# Altium schematic sheet Heater.SchDoc: Heater
size 420 x 297 mm; EDA_Number: ARTIQ; Projet: GPSDO; Author: K.Belewicz/M.Beldyga; CompanyName: WUT ISE; DrawnBy: K.Belewicz/M.Beldyga; Organization: WUT ISE; Address1: PW ISE; Address2: Nowowiejska 15/19 00-665 Warsaw; Address3: gkasprow@gmail.com; Revision: 1; SheetNumber: 3; SheetTotal: 7; ModifiedBy: -; CheckedDate: -; DivGrp: WUT ISE; Designer: G.Kasprowicz; ModifiedDate: -; ProjectName: Sensor Box
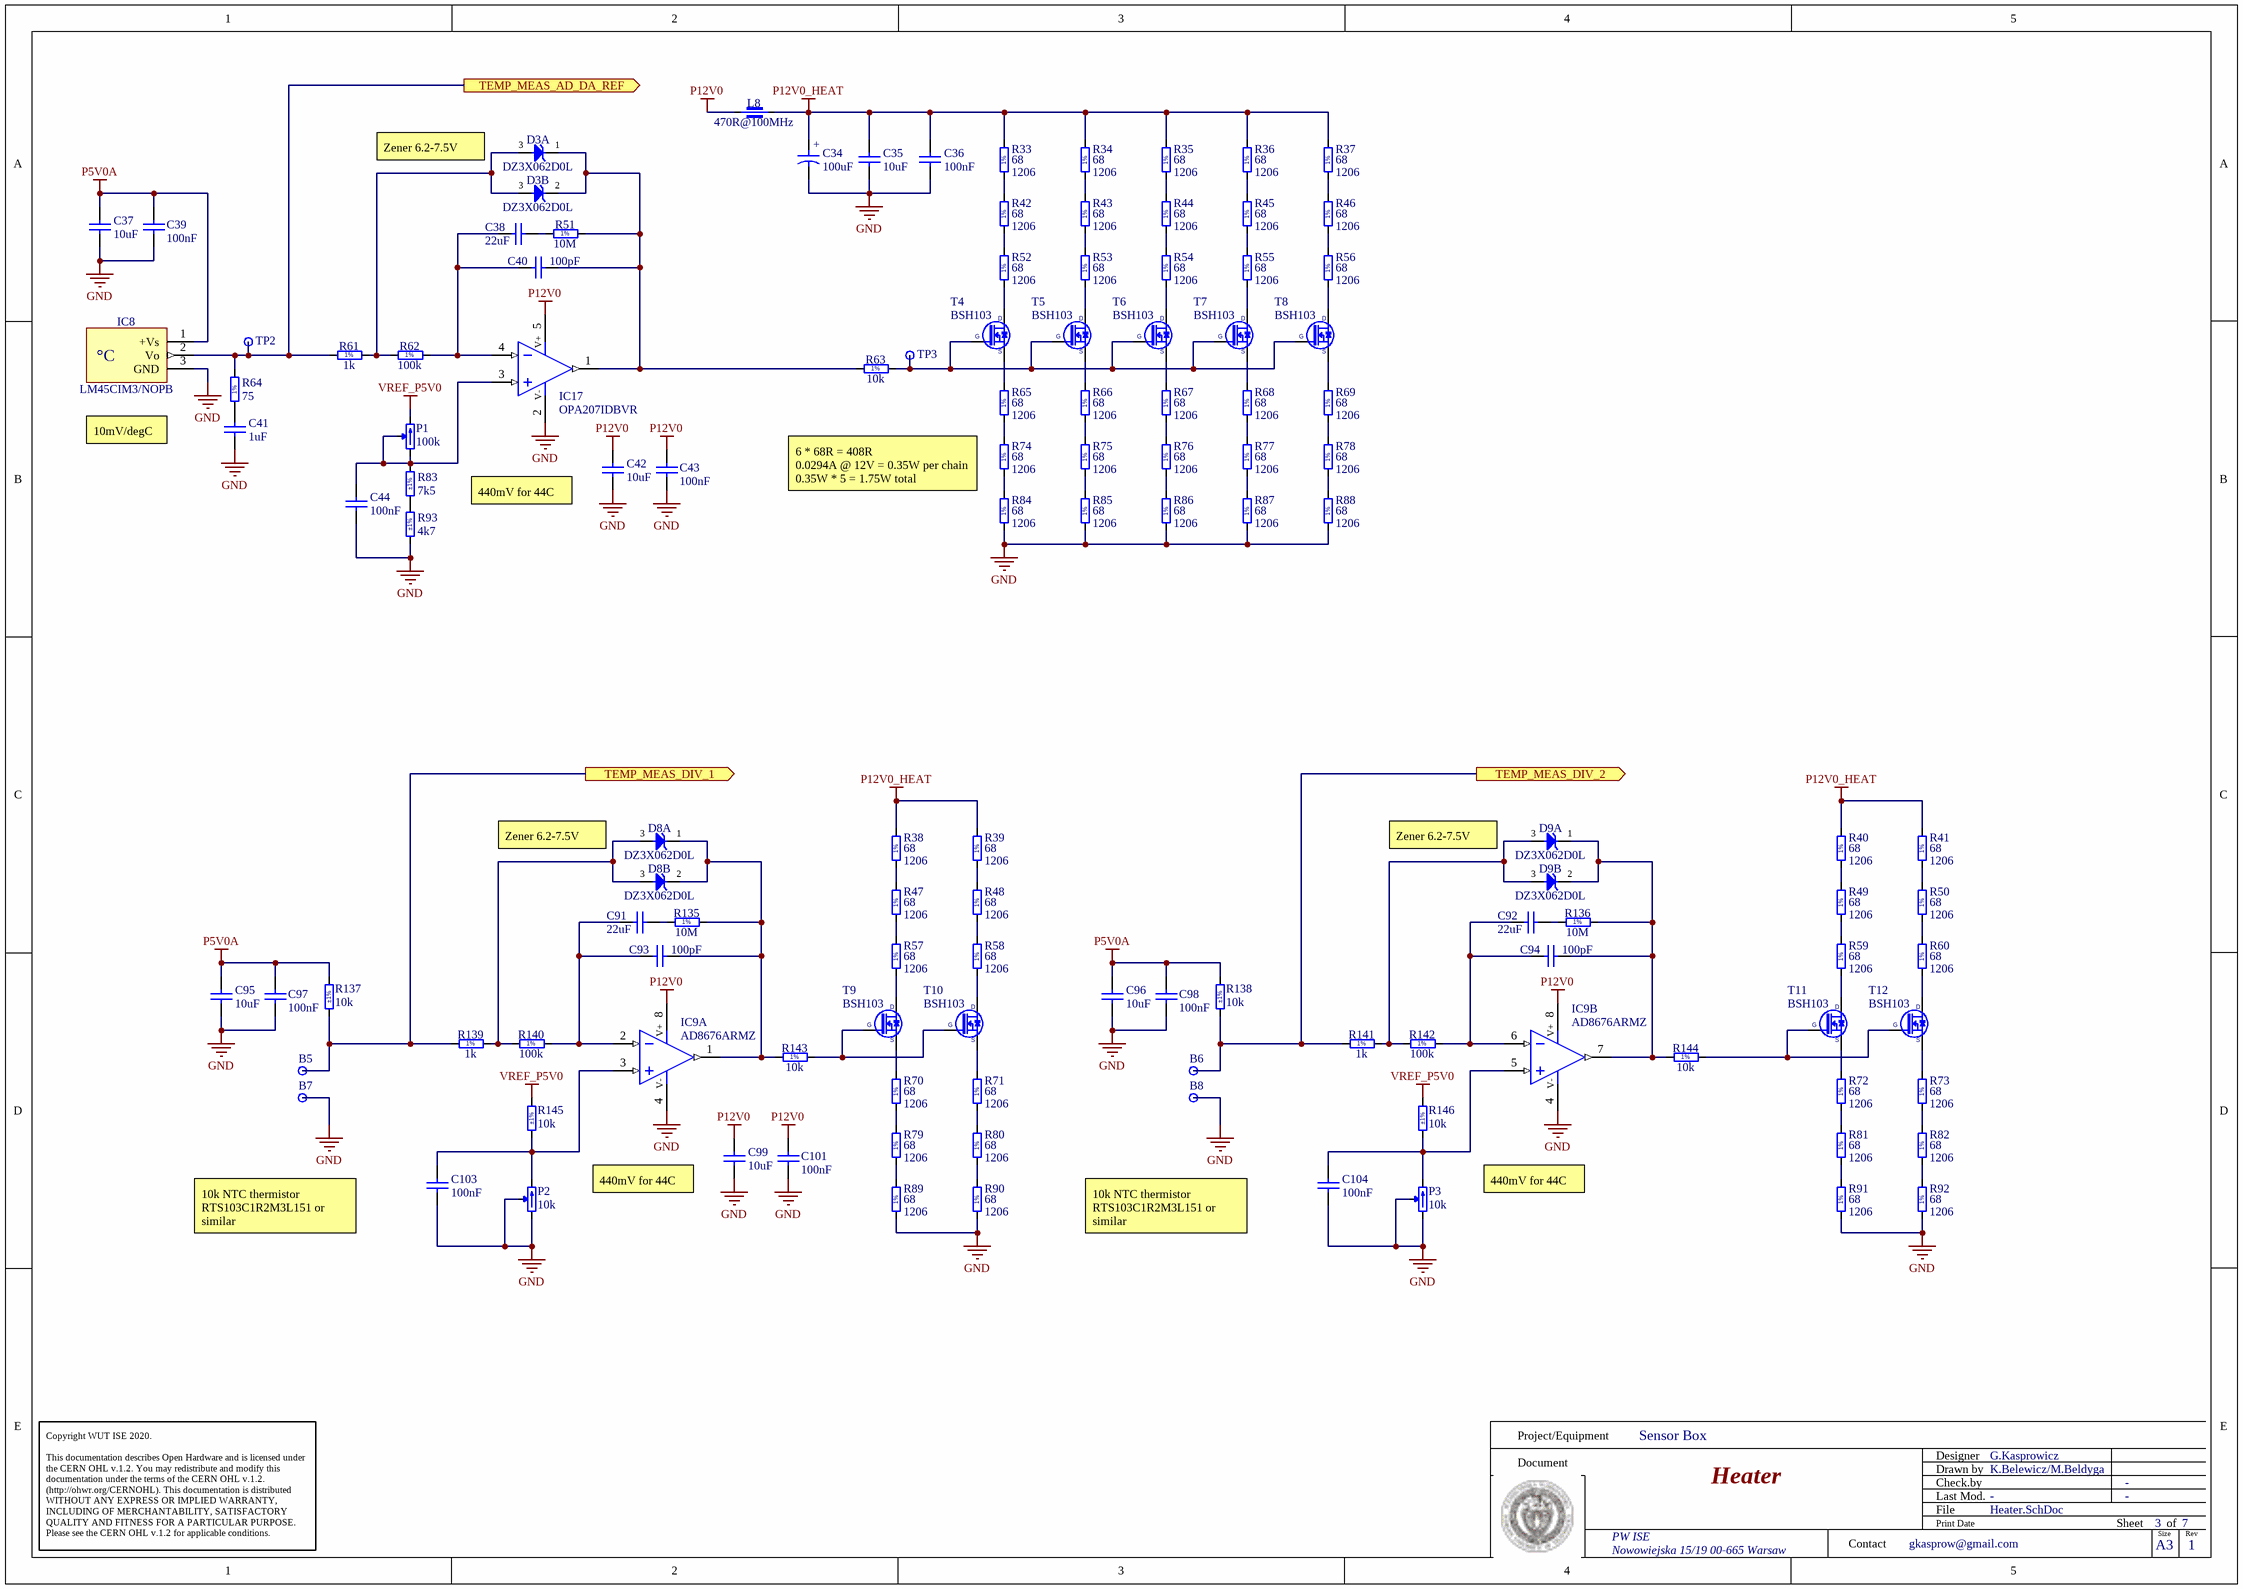
[diagram p0: Heater.SchDoc]

## Parts
B5  Plated Hole  [c150h80]  (value not drawn)  (no BOM)
B6  Plated Hole  [c150h80]  (value not drawn)  (no BOM)
B7  Plated Hole  [c150h80]  (value not drawn)  (no BOM)
B8  Plated Hole  [c150h80]  (value not drawn)  (no BOM)
C34  100uF  [CAPMP7343X310N]
C35  10uF  [CAPC1608X80N]
C36  100nF  [CAPC1005X55N]
C37  10uF  [CAPC1608X80N]
C38  22uF  [CAPC2012X135N]
C39  100nF  [CAPC1005X55N]
C40  100pF  [CAPC1005X55N]
C41  1uF  [CAPC1005X55N]
C42  10uF  [CAPC1608X80N]
C43  100nF  [CAPC1005X55N]
C44  100nF  [CAPC1005X55N]
C91  22uF  [CAPC2012X135N]
C92  22uF  [CAPC2012X135N]
C93  100pF  [CAPC1005X55N]
C94  100pF  [CAPC1005X55N]
C95  10uF  [CAPC1608X80N]
C96  10uF  [CAPC1608X80N]
C97  100nF  [CAPC1005X55N]
C98  100nF  [CAPC1005X55N]
C99  10uF  [CAPC1608X80N]
C101  100nF  [CAPC1005X55N]
C103  100nF  [CAPC1005X55N]
C104  100nF  [CAPC1005X55N]
D3  DZ3X062D0L  [SOT95P275X140-3N]  (parts A,B of 2)
D8  DZ3X062D0L  [SOT95P275X140-3N]  (parts A,B of 2)
D9  DZ3X062D0L  [SOT95P275X140-3N]  (parts A,B of 2)
IC8  LM45CIM3/NOPB  [SOT95P251X112-3N]
IC9  AD8676ARMZ  [SOP65P490X110-8N]  (parts A,B of 2)
IC17  OPA207IDBVR  [SOT95P280X145-5N]
L8  470R@100MHz  [INDC1608X95N]
P1  100k  [TRIM_BOURNS_3224X]
P2  10k  [TRIM_BOURNS_3224X]
P3  10k  [TRIM_BOURNS_3224X]
R33  68  Case: 1206  [RESC3216X65N]
R34  68  Case: 1206  [RESC3216X65N]
R35  68  Case: 1206  [RESC3216X65N]
R36  68  Case: 1206  [RESC3216X65N]
R37  68  Case: 1206  [RESC3216X65N]
R38  68  Case: 1206  [RESC3216X65N]
R39  68  Case: 1206  [RESC3216X65N]
R40  68  Case: 1206  [RESC3216X65N]
R41  68  Case: 1206  [RESC3216X65N]
R42  68  Case: 1206  [RESC3216X65N]
R43  68  Case: 1206  [RESC3216X65N]
R44  68  Case: 1206  [RESC3216X65N]
R45  68  Case: 1206  [RESC3216X65N]
R46  68  Case: 1206  [RESC3216X65N]
R47  68  Case: 1206  [RESC3216X65N]
R48  68  Case: 1206  [RESC3216X65N]
R49  68  Case: 1206  [RESC3216X65N]
R50  68  Case: 1206  [RESC3216X65N]
R51  10M  [RESC2113X55N]
R52  68  Case: 1206  [RESC3216X65N]
R53  68  Case: 1206  [RESC3216X65N]
R54  68  Case: 1206  [RESC3216X65N]
R55  68  Case: 1206  [RESC3216X65N]
R56  68  Case: 1206  [RESC3216X65N]
R57  68  Case: 1206  [RESC3216X65N]
R58  68  Case: 1206  [RESC3216X65N]
R59  68  Case: 1206  [RESC3216X65N]
R60  68  Case: 1206  [RESC3216X65N]
R61  1k  [RESC1005X40N]
R62  100k  [RESC1005X40N]
R63  10k  [RESC1005X40N]
R64  75  [RESC1005X40N]
R65  68  Case: 1206  [RESC3216X65N]
R66  68  Case: 1206  [RESC3216X65N]
R67  68  Case: 1206  [RESC3216X65N]
R68  68  Case: 1206  [RESC3216X65N]
R69  68  Case: 1206  [RESC3216X65N]
R70  68  Case: 1206  [RESC3216X65N]
R71  68  Case: 1206  [RESC3216X65N]
R72  68  Case: 1206  [RESC3216X65N]
R73  68  Case: 1206  [RESC3216X65N]
R74  68  Case: 1206  [RESC3216X65N]
R75  68  Case: 1206  [RESC3216X65N]
R76  68  Case: 1206  [RESC3216X65N]
R77  68  Case: 1206  [RESC3216X65N]
R78  68  Case: 1206  [RESC3216X65N]
R79  68  Case: 1206  [RESC3216X65N]
R80  68  Case: 1206  [RESC3216X65N]
R81  68  Case: 1206  [RESC3216X65N]
R82  68  Case: 1206  [RESC3216X65N]
R83  7k5  Tolerance: ±1%  [RESC1005X40N]
R84  68  Case: 1206  [RESC3216X65N]
R85  68  Case: 1206  [RESC3216X65N]
R86  68  Case: 1206  [RESC3216X65N]
R87  68  Case: 1206  [RESC3216X65N]
R88  68  Case: 1206  [RESC3216X65N]
R89  68  Case: 1206  [RESC3216X65N]
R90  68  Case: 1206  [RESC3216X65N]
R91  68  Case: 1206  [RESC3216X65N]
R92  68  Case: 1206  [RESC3216X65N]
R93  4k7  Tolerance: ±1%  [RESC1005X40N]
R135  10M  [RESC2113X55N]
R136  10M  [RESC2113X55N]
R137  10k  Tolerance: ±1%  [RESC1005X40N]
R138  10k  Tolerance: ±1%  [RESC1005X40N]
R139  1k  [RESC1005X40N]
R140  100k  [RESC1005X40N]
R141  1k  [RESC1005X40N]
R142  100k  [RESC1005X40N]
R143  10k  [RESC1005X40N]
R144  10k  [RESC1005X40N]
R145  10k  Tolerance: ±1%  [RESC1005X40N]
R146  10k  Tolerance: ±1%  [RESC1005X40N]
T4  BSH103  [SOT95P230X110-3N]
T5  BSH103  [SOT95P230X110-3N]
T6  BSH103  [SOT95P230X110-3N]
T7  BSH103  [SOT95P230X110-3N]
T8  BSH103  [SOT95P230X110-3N]
T9  BSH103  [SOT95P230X110-3N]
T10  BSH103  [SOT95P230X110-3N]
T11  BSH103  [SOT95P230X110-3N]
T12  BSH103  [SOT95P230X110-3N]
TP2  Test Point  [TPS127]  (value not drawn)  (no BOM)
TP3  Test Point  [TPS127]  (value not drawn)  (no BOM)

## Ports
TEMP_MEAS_AD_DA_REF (out), TEMP_MEAS_DIV_1 (out), TEMP_MEAS_DIV_2 (out)

## Nets
GND: B7.1 B8.1 C34.2 C35.1 C36.1 C37.1 C39.1 C41.1 C42.1 C43.1 C44.1 C95.1 C96.1 C97.1 C98.1 C99.1 C101.1 C103.1 C104.1 IC8.3(GND) IC9.4(V-) IC17.2(V-) P2.1(CCW) P2.2(W) P3.1(CCW) P3.2(W) R84.1 R85.1 R86.1 R87.1 R88.1 R89.1 R90.1 R91.1 R92.1 R93.1
P5V0A: C37.2 C39.2 C95.2 C96.2 C97.2 C98.2 IC8.1(+Vs) R137.2 R138.2
P12V0: C42.2 C43.2 C99.2 C101.2 IC9.8(V+) IC17.5(V+) L8.1
P12V0_HEAT: C34.1 C35.2 C36.2 L8.2 R33.2 R34.2 R35.2 R36.2 R37.2 R38.2 R39.2 R40.2 R41.2
VREF_P5V0: P1.3(CW) R145.2 R146.2
TEMP_MEAS_AD_DA_REF: IC8.2(Vo) R61.1 R64.2 TP2.1 ; port TEMP_MEAS_AD_DA_REF
TEMP_MEAS_DIV_1: B5.1 R137.1 R139.1 ; port TEMP_MEAS_DIV_1
TEMP_MEAS_DIV_2: B6.1 R138.1 R141.1 ; port TEMP_MEAS_DIV_2
NetC38_1: C38.1 C40.1 IC17.4(IN-) R62.2
NetC38_2: C38.2 R51.1
NetC40_2: C40.2 D3.1(C) D3.2(C) IC17.1(OUT) R51.2 R63.1
NetC41_2: C41.2 R64.1
NetC44_2: C44.2 IC17.3(IN+) P1.1(CCW) P1.2(W) R83.2
NetC91_1: C91.1 C93.1 IC9.2(IN-) R140.2
NetC91_2: C91.2 R135.1
NetC92_1: C92.1 C94.1 IC9.6(IN-) R142.2
NetC92_2: C92.2 R136.1
NetC93_2: C93.2 D8.1(C) D8.2(C) IC9.1(OUT) R135.2 R143.1
NetC94_2: C94.2 D9.1(C) D9.2(C) IC9.7(OUT) R136.2 R144.1
NetC103_2: C103.2 IC9.3(IN+) P2.3(CW) R145.1
NetC104_2: C104.2 IC9.5(IN+) P3.3(CW) R146.1
NetD3_3: D3.3(COMA) R61.2 R62.1
NetD8_3: D8.3(COMA) R139.2 R140.1
NetD9_3: D9.3(COMA) R141.2 R142.1
NetR33_1: R33.1 R42.2
NetR34_1: R34.1 R43.2
NetR35_1: R35.1 R44.2
NetR36_1: R36.1 R45.2
NetR37_1: R37.1 R46.2
NetR38_1: R38.1 R47.2
NetR39_1: R39.1 R48.2
NetR40_1: R40.1 R49.2
NetR41_1: R41.1 R50.2
NetR42_1: R42.1 R52.2
NetR43_1: R43.1 R53.2
NetR44_1: R44.1 R54.2
NetR45_1: R45.1 R55.2
NetR46_1: R46.1 R56.2
NetR47_1: R47.1 R57.2
NetR48_1: R48.1 R58.2
NetR49_1: R49.1 R59.2
NetR50_1: R50.1 R60.2
NetR52_1: R52.1 T4.3(D)
NetR53_1: R53.1 T5.3(D)
NetR54_1: R54.1 T6.3(D)
NetR55_1: R55.1 T7.3(D)
NetR56_1: R56.1 T8.3(D)
NetR57_1: R57.1 T9.3(D)
NetR58_1: R58.1 T10.3(D)
NetR59_1: R59.1 T11.3(D)
NetR60_1: R60.1 T12.3(D)
NetR63_2: R63.2 T4.1(G) T5.1(G) T6.1(G) T7.1(G) T8.1(G) TP3.1
NetR65_1: R65.1 R74.2
NetR65_2: R65.2 T4.2(S)
NetR66_1: R66.1 R75.2
NetR66_2: R66.2 T5.2(S)
NetR67_1: R67.1 R76.2
NetR67_2: R67.2 T6.2(S)
NetR68_1: R68.1 R77.2
NetR68_2: R68.2 T7.2(S)
NetR69_1: R69.1 R78.2
NetR69_2: R69.2 T8.2(S)
NetR70_1: R70.1 R79.2
NetR70_2: R70.2 T9.2(S)
NetR71_1: R71.1 R80.2
NetR71_2: R71.2 T10.2(S)
NetR72_1: R72.1 R81.2
NetR72_2: R72.2 T11.2(S)
NetR73_1: R73.1 R82.2
NetR73_2: R73.2 T12.2(S)
NetR74_1: R74.1 R84.2
NetR75_1: R75.1 R85.2
NetR76_1: R76.1 R86.2
NetR77_1: R77.1 R87.2
NetR78_1: R78.1 R88.2
NetR79_1: R79.1 R89.2
NetR80_1: R80.1 R90.2
NetR81_1: R81.1 R91.2
NetR82_1: R82.1 R92.2
NetR83_1: R83.1 R93.2
NetR143_2: R143.2 T9.1(G) T10.1(G)
NetR144_2: R144.2 T11.1(G) T12.1(G)

## Notes on the sheet
- (near D3) Zener 6.2-7.5V
- 10mV/degC
- 440mV for 44C
- 6 * 68R = 408R
  0.0294A @ 12V = 0.35W per chain
  0.35W * 5 = 1.75W total
- (near D8) Zener 6.2-7.5V
- (near D9) Zener 6.2-7.5V
- 10k NTC thermistor RTS103C1R2M3L151 or similar
- Project/Equipment
- Document
- Designer
- Drawn by
- Check.by
- Copyright WUT ISE 2020.
  This documentation describes Open Hardware and is licensed under the CERN OHL v.1.2. You may redistribute and modify this documentation under the terms of the CERN OHL v.1.2. (http://ohwr.org/CERNOHL). This documentation is distributed WITHOUT ANY EXPRESS OR IMPLIED WARRANTY, INCLUDING OF MERCHANTABILITY, SATISFACTORY QUALITY AND FITNESS FOR A PARTICULAR PURPOSE. Please see the CERN OHL v.1.2 for applicable conditions.
- Contact
- File
- Last Mod.
- Print Date
- Sheet
- Size
- A3
- of
- Rev
- (in symbol CTE7343-31_100UF_20V_10%) +
- (in symbol LM45CIM3/NOPB) °C
- (in symbol R0402_1k_1%_0.0625W_100PPM) 1%
- (in symbol R0402_10K_1%_0.0625W_100PPM) 1%
- (in symbol R0402_75R_1%_0.0625W_100PPM) 1%
- (in symbol R0402_100K_1%_0.0625W_100PPM) 1%
- (in symbol R0805_10M_1%_0.125W_100PPM_VISHAY_CRCW e3) 1%
- (in symbol R1206_68R_1%_0.25W_100PPM) 1%

## Library data of the parts
B5-B8 = PLATED_HOLE0.8_PAD1.5: Single Terminal Socket; Part Description: Plated Through Hole: Hole Dia.=0.8mm Pad Dia.=1.5mm, IPC-7251 Level A; Mounted: No; Part Number: PLATED_HOLE0.8_PAD1.5; Component Type: Standard (No BOM); Pin Count: 1; Family: Plated Hole; Socket: No; SMD: No; Sense: No; Status: None; ComponentHeight: 0mm; HelpURL: Undefined; Author: CERN DEM JLC; CreateDate: 5/11/2017; LatestRevisionDate: 5/11/2017; PackageDescription: Plated Through Hole: Hole Dia.=0.8mm Pad Dia.=1.3mm, IPC-7251 Level A
C34 = CTE7343-31_100UF_20V_10%: Polarised capacitor; Part Description: Solid Tantalum Chip Capacitor; Manufacturer: GENERIC; Manufacturer1 Part Number: TAJD107K020R; Voltage: 20V; Tolerance: ±10%; Part Number: CTE7343-31_100UF_20V_10%; Component Kind: Standard; Component Type: Standard; Pin Count: 2; Value: 100uF; Status: Preferred; Manufacturer Part Number: CTE7343-31_100UF_20V_10%; Case: D; Mounted: Yes; Socket: No; SMD: Yes; Sense: No; Manufacturer1 Example: AVX; Manufacturer1 ComponentHeight: 3.1mm; HelpURL: \\cern.ch\dfs\Applications\Altium\Datasheets\CTE_AVX_TAJ.pdf; Author: CERN DEM JLC; CreateDate: 03/12/2007; LatestRevisionDate: 03/12/2007
C35 C37 C42 C95 C96 C99 = CC0603_10UF_10V_10%_X5R: Non-polarised capacitor; Part Description: SMD Multilayer Chip Ceramic Capacitor; Manufacturer: GENERIC; Manufacturer1 Part Number: GRM188R61A106KE69D; Voltage: 10V; TC: X5R; Tolerance: ±10%; Part Number: CC0603_10UF_10V_10%_X5R; Component Kind: Standard; Component Type: Standard; Pin Count: 2; Value: 10uF; Status: None; Manufacturer Part Number: CC0603_10UF_10V_10%_X5R; Case: 0603; Mounted: Yes; Socket: No; SMD: Yes; Sense: No; Manufacturer1 Example: MURATA; Manufacturer1 ComponentHeight: 0.8mm; HelpURL: \\cern.ch\dfs\Applications\Altium\Datasheets\CC0603_MURATA_GRM188R61A106KE69D.pdf; Author: CERN DEM JLC; CreateDate: 31.01.2017; LatestRevisionDate: 31.01.2017
C36 C44 C103 C104 = CC0402_100NF_16V_10%_X5R: Non-polarised capacitor; Part Description: SMD Multilayer Chip Ceramic Capacitor; Manufacturer: GENERIC; Manufacturer1 Part Number: GRM155R61C104KA88D; Voltage: 16V; TC: X5R; Tolerance: ±10%; Part Number: CC0402_100NF_16V_10%_X5R; Component Kind: Standard; Component Type: Standard; Pin Count: 2; Value: 100nF; Status: None; Manufacturer Part Number: CC0402_100NF_16V_10%_X5R; Case: 0402; Mounted: Yes; Socket: No; SMD: Yes; Sense: No; Manufacturer1 Example: MURATA; Manufacturer1 ComponentHeight: 0.55mm; HelpURL: \\cern.ch\dfs\Applications\Altium\Datasheets\CC0402_X5R_MURATA_GRM.pdf; Author: CERN DEM JLC; CreateDate: 10.12.2013; LatestRevisionDate: 10.12.2013
C38 C91 C92 = CC0805_22UF_16V_10%_X5R: Non-polarised capacitor; Manufacturer: GENERIC; Part Description: SMD Multilayer Chip Ceramic Capacitor; Manufacturer1 Part Number: C2012X5R1C226KT; Tolerance: ±10%; Voltage: 16V; TC: X5R; Manufacturer Part Number: CC0805_22UF_16V_10%_X5R; Part Number: CC0805_22UF_16V_10%_X5R; Value: 22uF; Component Kind: Standard; Component Type: Standard; Pin Count: 2; Status: Preferred; Case: 0805; Mounted: Yes; Socket: No; SMD: Yes; Sense: No; Manufacturer1 Example: TDK; Manufacturer1 ComponentHeight: 1.35mm; HelpURL: \\cern.ch\dfs\Applications\Altium\Datasheets\CC0805_X5R_TDK_C.pdf; Author: CERN DEM JLC; CreateDate: 25.10.2012; LatestRevisionDate: 25.10.2012
C39 C43 C97 C98 C101 = CC0402_100NF_50V_10%_X7R: Non-polarised capacitor; Part Description: SMD Multilayer Chip Ceramic Capacitor; Manufacturer: GENERIC; Manufacturer1 Part Number: GRM155R71H104KE14D; Voltage: 50V; TC: X7R; Tolerance: ±10%; Part Number: CC0402_100NF_50V_10%_X7R; Component Kind: Standard; Component Type: Standard; Pin Count: 2; Value: 100nF; Status: None; Manufacturer Part Number: CC0402_100NF_50V_10%_X7R; Case: 0402; Mounted: Yes; Socket: No; SMD: Yes; Sense: No; Manufacturer1 Example: MURATA; Manufacturer1 ComponentHeight: 0.55mm; HelpURL: \\cern.ch\dfs\Applications\Altium\Datasheets\CC0402_MURATA_GRM155R71H104KE14D.pdf; Author: CERN DEM MR; CreateDate: 6/30/2017; LatestRevisionDate: 6/30/2017
C40 C93 C94 = CC0402_100PF_50V_5%_C0G: Non-polarised capacitor; Part Description: SMD Multilayer Chip Ceramic Capacitor; Manufacturer: GENERIC; Manufacturer1 Part Number: C0402C101J5GACTU; Voltage: 50V; TC: C0G/NP0; Tolerance: ±5%; Part Number: CC0402_100PF_50V_5%_C0G; Component Kind: Standard; Component Type: Standard; Pin Count: 2; Value: 100pF; Status: Preferred; Manufacturer Part Number: CC0402_100PF_50V_5%_C0G; Case: 0402; Mounted: Yes; Socket: No; SMD: Yes; Sense: No; Manufacturer1 Example: KEMET; Manufacturer1 ComponentHeight: 0.55mm; HelpURL: \\cern.ch\dfs\Applications\Altium\Datasheets\CC0402_C0G_KEMET_(Commercial Grade).pdf; Author: CERN DEM JLC; CreateDate: 03/12/2007; LatestRevisionDate: 22/04/2015
C41 = CC0402_1UF_16V_10%_X5R: Non-polarised capacitor; Part Description: SMD Multilayer Chip Ceramic Capacitor; Manufacturer: GENERIC; Manufacturer1 Part Number: C1005X5R1C105KT; Voltage: 16V; TC: X5R; Tolerance: ±10%; Part Number: CC0402_1UF_16V_10%_X5R; Component Kind: Standard; Component Type: Standard; Pin Count: 2; Value: 1uF; Status: Preferred; Manufacturer Part Number: CC0402_1UF_16V_10%_X5R; Case: 0402; Mounted: Yes; Socket: No; SMD: Yes; Sense: No; Manufacturer1 Example: TDK; Manufacturer1 ComponentHeight: 0.55mm; HelpURL: \\cern.ch\dfs\Applications\Altium\Datasheets\CC0402_X5R_TDK_C.pdf; Author: CERN DEM JLC; CreateDate: 25.10.2012; LatestRevisionDate: 25.10.2012
D3 D8 D9 = DZ3X062D0L: Dual Common Anode Zener Diode; Part Description: Dual Common Anode Silicon Epitaxial Planar Diode; Manufacturer: PANASONIC; Voltage: 6.2V; Power: 200mA; PressFit: No; Bonding: No; Part Number: DZ3X062D0L; Component Kind: Standard; Component Type: Standard; Device: DZ3X062D0L; PackageDescription: SOT, 0.95mm Pitch; 3 Pin, 1.60mm W X 2.975mm L X 1.40mm H Body, IPC Medium Density; Manufacturer Part Number: DZ3X062D0L; Pin Count: 3; Case: SOT23-3; Mounted: Yes; Socket: No; SMD: Yes; Sense: No; ComponentHeight: 1.40mm; HelpURL: \\cern.ch\dfs\Applications\Altium\Datasheets\DZ3X062D0L.pdf; Author: CERN DEM JLC; CreateDate: 30/09/2014; LatestRevisionDate: 30/09/2014
IC8 = LM45CIM3/NOPB: -20° to +100°C ±3°C Precision Centigrade Temperature Sensors; Manufacturer: TEXAS INSTRUMENTS; PressFit: No; Bonding: No; Part Number: LM45CIM3/NOPB; Component Kind: Standard; Component Type: Standard; Device: LM45CIM3/NOPB; PackageDescription: SOT, 0.95mm Pitch; 3 Pin, 1.30mm W X 2.92mm L X 1.12mm H body, IPC Medium Density; Part Description: -20° to +100°C ±3°C Precision Centigrade Temperature Sensors; Manufacturer Part Number: LM45CIM3/NOPB; Pin Count: 3; Case: SOT23; Mounted: Yes; Socket: No; SMD: Yes; Sense: No; ComponentHeight: 1.12mm; HelpURL: \\cern.ch\dfs\Applications\Altium\Datasheets\LM45CIM3-NOPB.pdf; Author: CERN DEM JLC; CreateDate: 19/01/2011; LatestRevisionDate: 19/01/2011
IC9 = AD8676ARMZ: Dual Operational Amplifier; Part Description: Ultraprecision, 36 V, 2.8 nV/sqrt Hz Dual Rail-to-Rail Output Operational Amplifier; Manufacturer: ANALOG DEVICES; PressFit: No; Bonding: No; Part Number: AD8676ARMZ; Component Kind: Standard; Component Type: Standard; Device: AD8676ARMZ; PackageDescription: SOP, 0.65mm Pitch; 8 Pin, 3.00mm W X 3.00mm L X 1.10mm H body, IPC Medium Density; Manufacturer Part Number: AD8676ARM; Pin Count: 8; Case: MSOP8; Mounted: Yes; Socket: No; SMD: Yes; Sense: No; ComponentHeight: 1.1mm; Author: CERN DEM JLC; HelpURL: \\cern.ch\dfs\Applications\Altium\Datasheets\AD8676ARMZ.pdf; CreateDate: 12/17/2013; LatestRevisionDate: 3/31/2022
IC17 = OPA207IDBVR: 2.2nV/sqrt Hz, Low-Power, 36-V Operational Amplifier; Manufacturer: TEXAS INSTRUMENTS; Part Number: OPA207IDBVR; Device: OPA207IDBVR; Component Kind: Standard; Component Type: Standard; PackageDescription: SOT, 0.95mm pitch; 5 pin, 1.60mm W X 2.90mm L X 1.45mm H body, IPC Medium Density; Part Description: 2.2nV/sqrt Hz, Low-Power, 36-V Operational Amplifier; Case: SOT 23-5; Manufacturer Part Number: OPA207IDBVR
L8 = IND0603_MURATA_BLM18PG471SN1D: Part Description: SMD EMIFIL Chip Ferrite Bead; Manufacturer: MURATA; Power: 1A; Resistance: 0.2R; Tolerance: ±25%; Part Number: IND0603_MURATA_BLM18PG471SN1D; Component Kind: Standard; Component Type: Standard; Pin Count: 2; Value: 470R@100MHz; Manufacturer Part Number: BLM18PG471SN1D; Case: 0603; Mounted: Yes; Socket: No; SMD: Yes; Sense: No; ComponentHeight: 0.95mm; HelpURL: \\cern.ch\dfs\Applications\Altium\Datasheets\IND0603_MURATA_BLM18P.pdf; Author: CERN DEM BC; CreateDate: 17.02.2021; LatestRevisionDate: 17.02.2021
P1 = TRIM_12T_100K_BOURNS_3224X-1-104E: Trimming Potentiometer; Part Description: 12 Turns SMD Trimpot® Trimming Potentiometer (Top Adjust); Manufacturer: BOURNS; Power: 0.25W; TC: ±100ppm/°C; Tolerance: ±10%; PressFit: No; Part Number: TRIM_12T_100K_BOURNS_3224X-1-104E; Component Kind: Standard; Component Type: Standard; Pin Count: 3; Value: 100k; Manufacturer Part Number: 3224X-1-104E; Case: 3224X; Mounted: Yes; Socket: No; SMD: Yes; Sense: No; ComponentHeight: 5.3mm; HelpURL: \\cern.ch\dfs\Applications\Altium\Datasheets\TRIM_BOURNS_3224X.pdf; Author: CERN DEM JLC; CreateDate: 12/18/2012; LatestRevisionDate: 12/18/2012
P2 P3 = TRIM_12T_10K_BOURNS_3224X-1-103E: Trimming Potentiometer; Part Description: 12 Turns SMD Trimpot® Trimming Potentiometer (Top Adjust); Manufacturer: BOURNS; Power: 0.25W; TC: ±100ppm/°C; Tolerance: ±10%; PressFit: No; Part Number: TRIM_12T_10K_BOURNS_3224X-1-103E; Component Kind: Standard; Component Type: Standard; Pin Count: 3; Value: 10k; Manufacturer Part Number: 3224X-1-103E; Case: 3224X; Mounted: Yes; Socket: No; SMD: Yes; Sense: No; ComponentHeight: 5.3mm; HelpURL: \\cern.ch\dfs\Applications\Altium\Datasheets\TRIM_BOURNS_3224X.pdf; Author: CERN DEM JLC; CreateDate: 12/18/2012; LatestRevisionDate: 12/18/2012
R33-R50 R52-R60 R65-R82 R84-R92 = R1206_68R_1%_0.25W_100PPM: Resistor - 1%; Part Description: General Purpose Thick Film Chip Resistor; Manufacturer: GENERIC; Manufacturer1 Part Number: NRC12F68R0TRF; Power: 0.25W; TC: ±100ppm/°C; PressFit: No; Part Number: R1206_68R_1%_0.25W_100PPM; Component Kind: Standard; Component Type: Standard; Pin Count: 2; Value: 68; Status: Preferred; Tolerance: ±1%; Manufacturer Part Number: R1206_68R_1%_0.25W_100PPM; Mounted: Yes; Sense: No; Socket: No; SMD: Yes; Manufacturer1 Example: NIC COMPONENT; Manufacturer1 ComponentHeight: 0.65mm; HelpURL: \\cern.ch\dfs\Applications\Altium\Datasheets\R1206_NIC_NRC.pdf; Author: CERN DEM JLC; CreateDate: 03/12/2007; LatestRevisionDate: 13/03/2008
R51 R135 R136 = R0805_10M_1%_0.125W_100PPM_VISHAY_CRCW e3: Resistor - 1%; Part Description: 150V, Standard Thick Film Chip Resistor; Manufacturer: VISHAY DALE; Manufacturer Part Number: CRCW080510M0FKEA; Power: 0.125W; TC: ±100ppm/°C; PressFit: No; Part Number: R0805_10M_1%_0.125W_100PPM_VISHAY_CRCW e3; Component Kind: Standard; Component Type: Standard; Pin Count: 2; Value: 10M; Status: None; Tolerance: ±1%; Case: 0805; Mounted: Yes; Sense: No; Socket: No; SMD: Yes; ComponentHeight: 0.5mm; HelpURL: \\cern.ch\dfs\Applications\Altium\Datasheets\R0805_VISHAY_CRCW e3.pdf; Author: CERN DEM BC; CreateDate: 2019-11-12; LatestRevisionDate: 2019-11-12
R61 R139 R141 = R0402_1k_1%_0.0625W_100PPM: Resistor - 1%; Part Description: General Purpose Thick Film Chip Resistor; Manufacturer: GENERIC; Manufacturer1 Part Number: 232270671002L; TC: ±100ppm/°C; PressFit: No; Part Number: R0402_1K_1%_0.0625W_100PPM; Component Kind: Standard; Component Type: Standard; Pin Count: 2; Value: 1k; Status: Not Recommended; Power: 0.0625W; Tolerance: ±1%; Manufacturer Part Number: R0402_1K_1%_0.0625W_100PPM; Case: 0402; Mounted: Yes; Sense: No; Socket: No; SMD: Yes; Manufacturer1 Example: YAGEO PHYCOMP; Manufacturer1 ComponentHeight: 0.4mm; HelpURL: \\cern.ch\dfs\Applications\Altium\Datasheets\R0402_Phycomp_RC0402.pdf; Author: CERN DEM JLC; CreateDate: 03.12.2007; LatestRevisionDate: 17.10.2012; ClassName: Artix
R62 R140 R142 = R0402_100K_1%_0.0625W_100PPM: Resistor - 1%; Part Description: General Purpose Thick Film Chip Resistor; Manufacturer: GENERIC; Manufacturer1 Part Number: 232270671004L; TC: ±100ppm/°C; PressFit: No; Part Number: R0402_100K_1%_0.0625W_100PPM; Component Kind: Standard; Component Type: Standard; Pin Count: 2; Value: 100k; Status: Not Recommended; Power: 0.0625W; Tolerance: ±1%; Manufacturer Part Number: R0402_100K_1%_0.0625W_100PPM; Case: 0402; Mounted: Yes; Sense: No; Socket: No; SMD: Yes; Manufacturer1 Example: YAGEO PHYCOMP; Manufacturer1 ComponentHeight: 0.4mm; HelpURL: \\cern.ch\dfs\Applications\Altium\Datasheets\R0402_Phycomp_RC0402.pdf; Author: CERN DEM JLC; CreateDate: 03/12/2007; LatestRevisionDate: 17/10/2012
R63 R137 R138 R143-R146 = R0402_10K_1%_0.0625W_100PPM: Resistor - 1%; Part Description: General Purpose Thick Film Chip Resistor; Manufacturer: GENERIC; Manufacturer1 Part Number: 232270671003L; TC: ±100ppm/°C; PressFit: No; Part Number: R0402_10K_1%_0.0625W_100PPM; Component Kind: Standard; Component Type: Standard; Pin Count: 2; Value: 10k; Status: Not Recommended; Power: 0.0625W; Manufacturer Part Number: R0402_10K_1%_0.0625W_100PPM; Case: 0402; Mounted: Yes; Sense: No; Socket: No; SMD: Yes; Manufacturer1 Example: YAGEO PHYCOMP; Manufacturer1 ComponentHeight: 0.4mm; HelpURL: \\cern.ch\dfs\Applications\Altium\Datasheets\R0402_Phycomp_RC0402.pdf; Author: CERN DEM JLC
  R63 R143 R144: Tolerance: ±1%; CreateDate: 03.12.2007; LatestRevisionDate: 17.10.2012
  R137 R138 R145 R146: CreateDate: 12/3/2007; LatestRevisionDate: 10/17/2012
R64 = R0402_75R_1%_0.0625W_100PPM: Resistor - 1%; Part Description: General Purpose Thick Film Chip Resistor; Manufacturer: GENERIC; Manufacturer1 Part Number: 232270677509L; TC: ±100ppm/°C; PressFit: No; Part Number: R0402_75R_1%_0.0625W_100PPM; Component Kind: Standard; Component Type: Standard; Pin Count: 2; Value: 75; Status: Not Recommended; Power: 0.0625W; Tolerance: ±1%; Manufacturer Part Number: R0402_75R_1%_0.0625W_100PPM; Case: 0402; Mounted: Yes; Sense: No; Socket: No; SMD: Yes; Manufacturer1 Example: YAGEO PHYCOMP; Manufacturer1 ComponentHeight: 0.4mm; HelpURL: \\cern.ch\dfs\Applications\Altium\Datasheets\R0402_Phycomp_RC0402.pdf; Author: CERN DEM JLC; CreateDate: 03/12/2007; LatestRevisionDate: 17/10/2012
R83 = R0402_7K5_1%_0.0625W_100PPM: Resistor - 1%; Part Description: General Purpose Thick Film Chip Resistor; Manufacturer: GENERIC; Manufacturer1 Part Number: 232270677502L; TC: ±100ppm/°C; PressFit: No; Part Number: R0402_7K5_1%_0.0625W_100PPM; Component Kind: Standard; Component Type: Standard; Pin Count: 2; Value: 7k5; Status: Not Recommended; Power: 0.0625W; Manufacturer Part Number: R0402_7K5_1%_0.0625W_100PPM; Case: 0402; Mounted: Yes; Sense: No; Socket: No; SMD: Yes; Manufacturer1 Example: YAGEO PHYCOMP; Manufacturer1 ComponentHeight: 0.4mm; HelpURL: \\cern.ch\dfs\Applications\Altium\Datasheets\R0402_Phycomp_RC0402.pdf; Author: CERN DEM JLC; CreateDate: 03.12.2007; LatestRevisionDate: 17.10.2012
R93 = R0402_4K7_1%_0.0625W_100PPM: Resistor - 1%; Part Description: General Purpose Thick Film Chip Resistor; Manufacturer: GENERIC; Manufacturer1 Part Number: 232270674702L; TC: ±100ppm/°C; PressFit: No; Part Number: R0402_4K7_1%_0.0625W_100PPM; Component Kind: Standard; Component Type: Standard; Pin Count: 2; Value: 4k7; Status: Not Recommended; Power: 0.0625W; Manufacturer Part Number: R0402_4K7_1%_0.0625W_100PPM; Case: 0402; Mounted: Yes; Sense: No; Socket: No; SMD: Yes; Manufacturer1 Example: YAGEO PHYCOMP; Manufacturer1 ComponentHeight: 0.4mm; HelpURL: \\cern.ch\dfs\Applications\Altium\Datasheets\R0402_Phycomp_RC0402.pdf; Author: CERN DEM JLC; CreateDate: 03.12.2007; LatestRevisionDate: 17.10.2012
T4-T12 = BSH103: N-CHANNEL MOSFET WITH DIODE; Part Description: 30V 850mA N-Channel Enhancement Mode Field-Effect Transistor; Manufacturer: NEXPERIA; PressFit: No; Bonding: No; Part Number: BSH103; Component Kind: Standard; Component Type: Standard; Device: BSH103; PackageDescription: SOT23, 3 pin, Pitch 0.95mm - 1.3mm W X 2.9mm L X 1.1mm H, IPC Medium Density; Manufacturer Part Number: BSH103; Pin Count: 3; Case: SOT23-3; Mounted: Yes; Socket: No; SMD: Yes; Sense: No; ComponentHeight: 1.1mm; HelpURL: \\cern.ch\dfs\Applications\Altium\Datasheets\BSH103.pdf; Author: CERN DEM JLC; CreateDate: 16.03.2010; LatestRevisionDate: 20.06.2017
TP2 TP3 = SMD_PAD_1.27X1.27MM: Part Description: 1.27mm x 1.27mm PCB Copper Area (SMD Test Point); Mounted: No; Part Number: SMD_PAD_1.27X1.27MM; Component Type: Standard (No BOM); Pin Count: 1; Family: Test Point; Socket: No; SMD: Yes; Sense: No; Status: None; ComponentHeight: 0mm; HelpURL: Undefined; Author: CERN DEM JLC; CreateDate: 12.01.2008; LatestRevisionDate: 12.01.2008; PackageDescription: 1.27mm x 1.27mm PCB Copper Area (SMD Test Point)